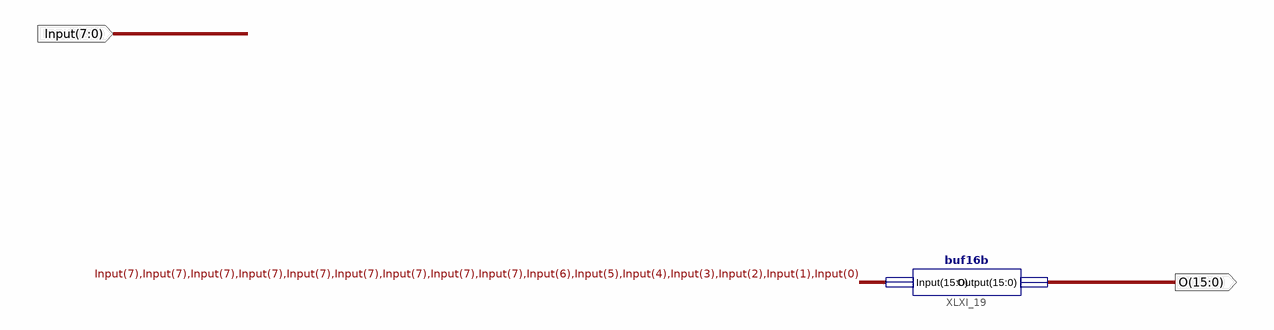
[diagram p0: schematic sheet 1]
// Xilinx ISE schematic signext8b16.sch (spartan3e) as structural Verilog: 1 symbols, 2 ports
module signext8b16 (
  input  [7:0] Input,
  output [15:0] O
);

  buf16b XLXI_19 (.Input({{9{Input[7]}}, Input[6:0]}), .Output(O));
endmodule
